# EAGLE design Thermocouple (EAGLE 7.1.0)
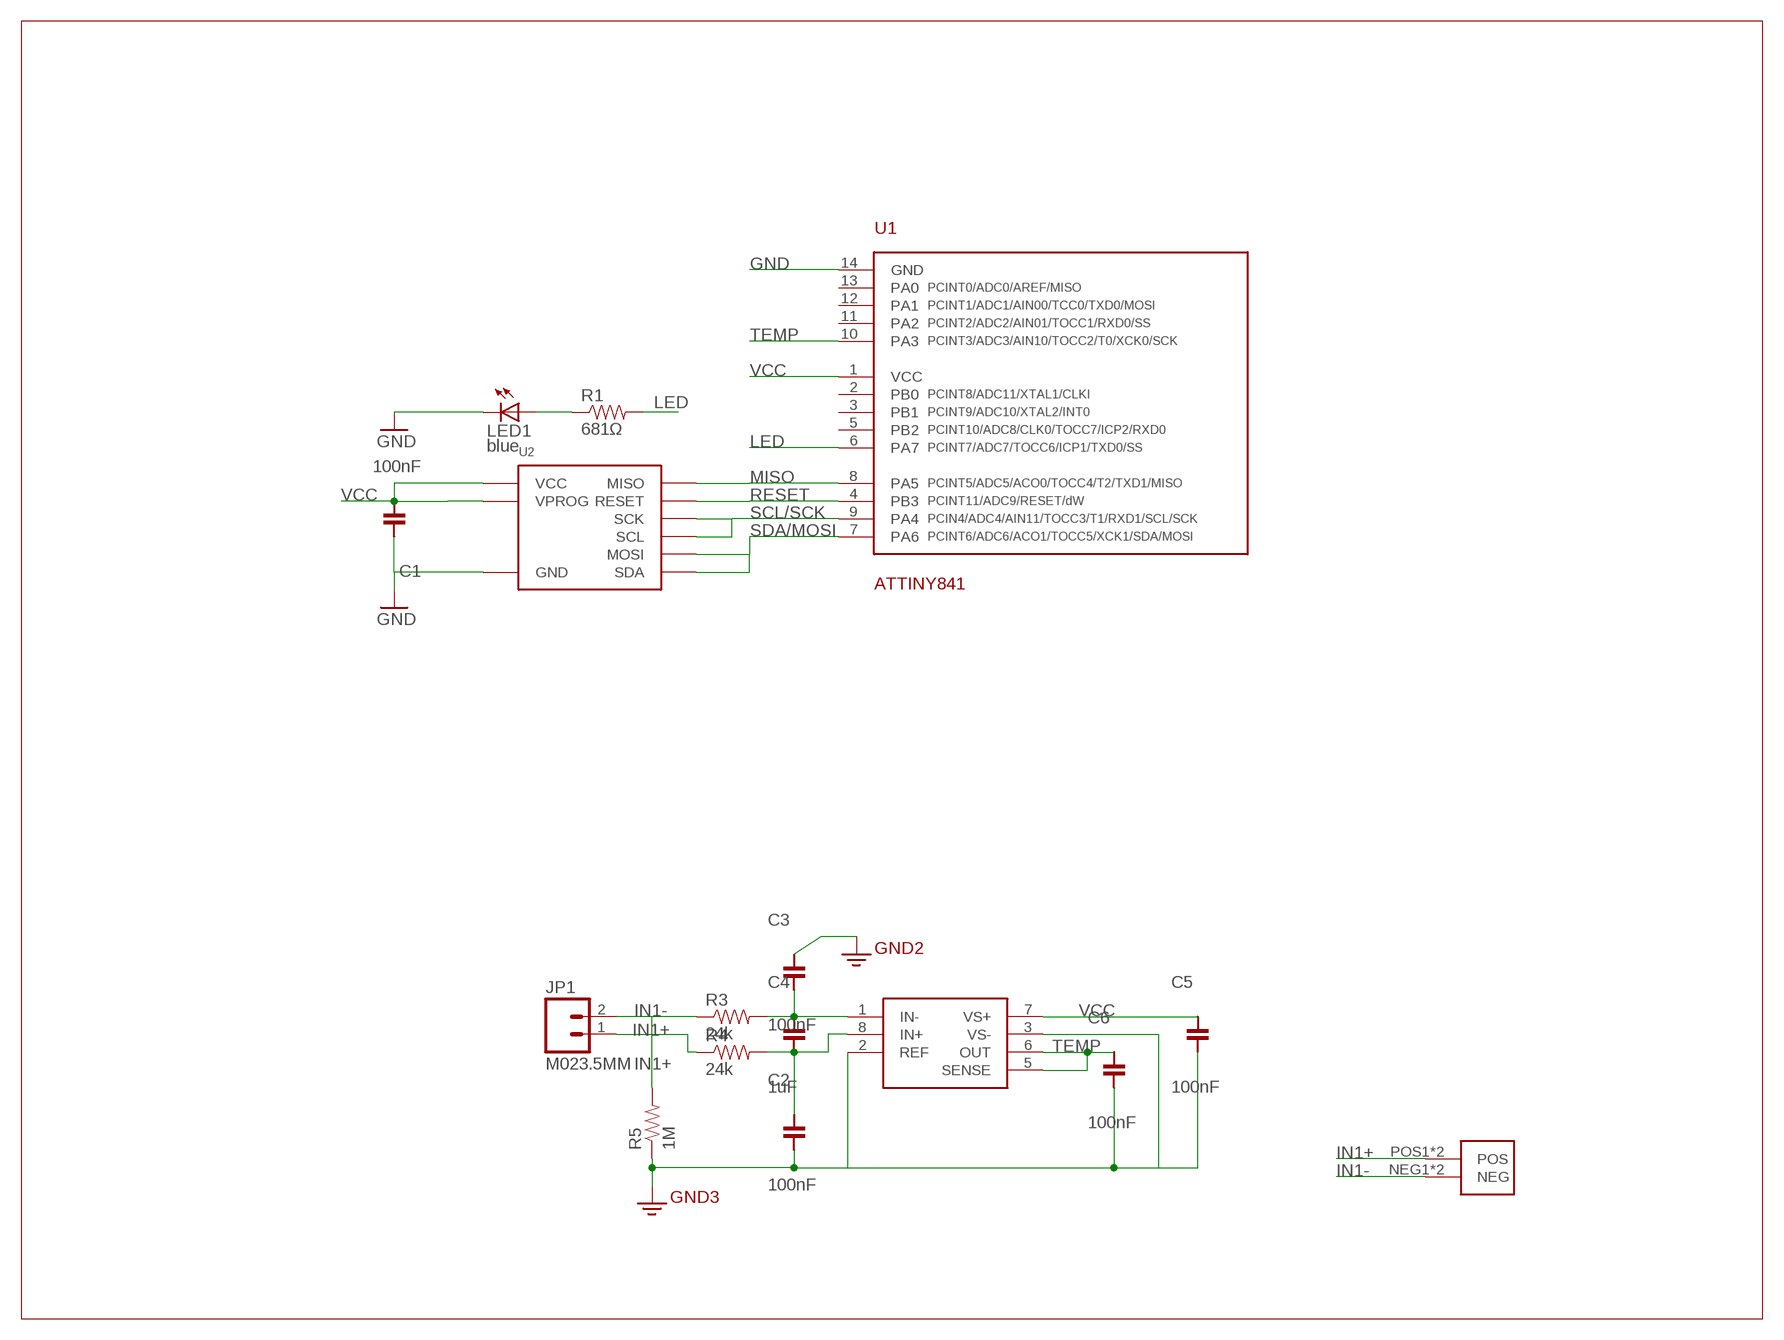
[diagram p0: schematic, sheet 1]

## Parts
C1  100nF  CAPACITOR-100NF  [0603]
C2  100nF  CAPACITOR-100NF  [0603]
C3  100nF  CAPACITOR-100NF  [0603]
C4  1uF  CAPACITOR-1UF  [0603]
C5  100nF  CAPACITOR-100NF  [0603]
C6  100nF  CAPACITOR-100NF  [0603]
JP1  M023.5MM  [SCREWTERMINAL-3.5MM-2]
LED1  blue  LED-0805-BLUE  [0805-LED]
R1  681Ω  RESISTOR-681Ω  [0603]
R3  24k  RESISTOR-0603  [0603]
R4  24k  RESISTOR-0603  [0603]
R5  1M  RESISTOR-0603  [0603]
U1  ATTINY841  [SOIC-14]
U2  EXCLUDE  DEVICE-PCB  [DEVICE-PCB]
U$1  AD8495  [MSOP-8]
U$4  THERMOCOUPLE-JACK  [THERMOCOUPLE-JACK]

## Nets
GND: C1.1 C2.2 C3.1 C5.2 C6.2 LED1.C R5.1 U1.14(GND) U2.BUS0(GND) U$1.2(REF) U$1.3(VS-) ; supply symbol labelled GND2
IN1+: JP1.1 R4.1 U$4.POS1(POS) U$4.POS2(POS)
IN1-: JP1.2 R3.1 R5.2 U$4.NEG1(NEG) U$4.NEG2(NEG)
LED: R1.2 U1.6(PA7)
MISO: U1.8(PA5) U2.PROG3(MISO)
N$3: C3.2 C4.1 R3.2 U$1.1(IN-)
N$4: C2.1 C4.2 R4.2 U$1.8(IN+)
N$8: LED1.A R1.1
RESET: U1.4(PB3) U2.PROG1(RESET)
SCL/SCK: U1.9(PA4) U2.BUS3(SCL) U2.PROG2(SCK)
SDA/MOSI: U1.7(PA6) U2.BUS1(SDA) U2.PROG4(MOSI)
TEMP: C6.1 U1.10(PA3) U$1.5(SENSE) U$1.6(OUT)
VCC: C1.2 C5.1 U1.1(VCC) U2.BUS2(VCC) U2.PROG0(VPROG) U$1.7(VS+)
Unconnected: U1.2(PB0) U1.3(PB1) U1.5(PB2) U1.11(PA2) U1.12(PA1) U1.13(PA0)

## Library data of the parts
C1-C3 C5 C6 = Modulo:CAPACITOR: Capacitor; PARTNUM: C0603C104K5RACTU
C4 = Modulo:CAPACITOR: Capacitor; PARTNUM: C0603C105K4RACTU
JP1 = SparkFun-Connectors:M02: Standard 2-pin 0.1" header. Use with - straight break away headers ( PRT-00116) - right angle break away headers (PRT-00553) - swiss pins (PRT-00743) - machine pins (PRT-00117) - female headers (PRT-00115) Molex polarized connector foot print use with: PRT-08233 with associated crimp pins and housings. 2.54_SCREWTERM for use with PRT-10571. 3.5mm Screw Terminal footprints for PRT-08084 5mm Screw Terminal footprints for use with PRT-08433; PARTNUM: OSTTE020104
LED1 = Modulo:LED: LED; PARTNUM: LTST-C171TBKT
R1 = Modulo:RESISTOR: Resistor Basic schematic elements and footprints for 0603, 1206, and PTH resistors.; PARTNUM: ERJ-3EKF6810V
R3 R4 = Modulo:RESISTOR: Resistor Basic schematic elements and footprints for 0603, 1206, and PTH resistors.; PARTNUM: ERJ-3EKF2402V
R5 = Modulo:RESISTOR: Resistor Basic schematic elements and footprints for 0603, 1206, and PTH resistors.; PARTNUM: ERJ-3EKF1004V
U1 = Modulo:ATTINY841; PARTNUM: ATTINY841-SSUR
U2 = Modulo:DEVICE-PCB: Modulo Footprint
U$1 = IntegerLabs:AD8495; PARTNUM: AD8495ARMZ-R7
U$4 = IntegerLabs:THERMOCOUPLE-JACK; PARTNUM: Keystone 3572, 3549

## Board
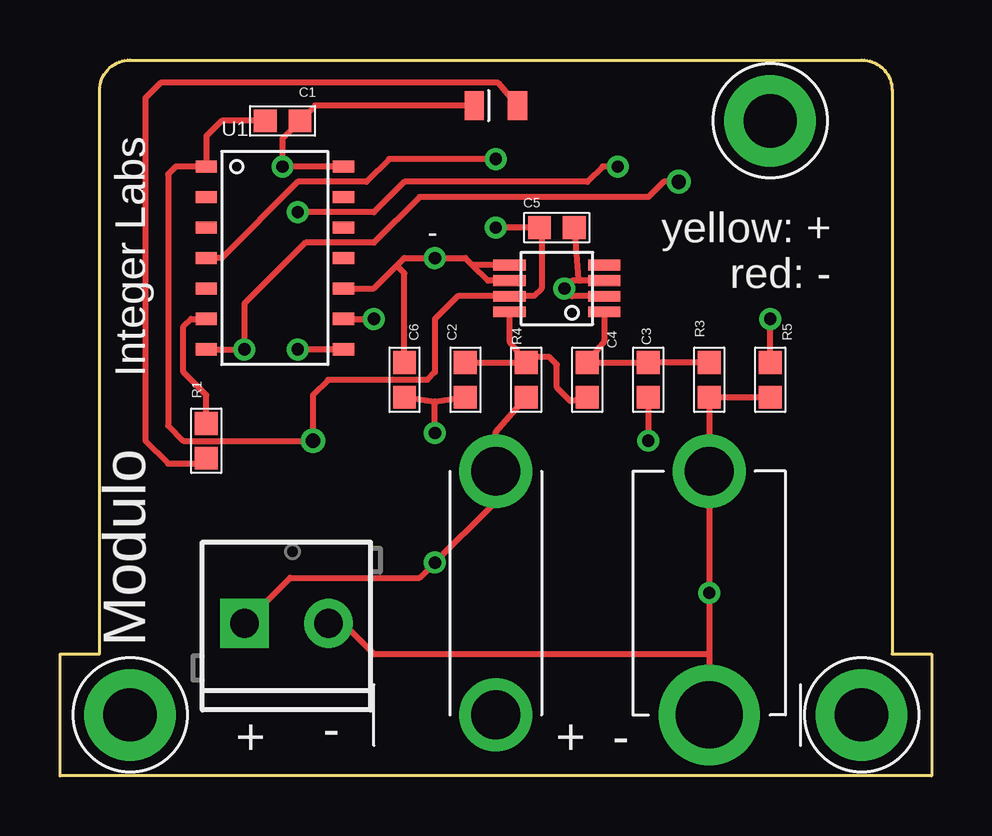
[diagram p1: board, top side]
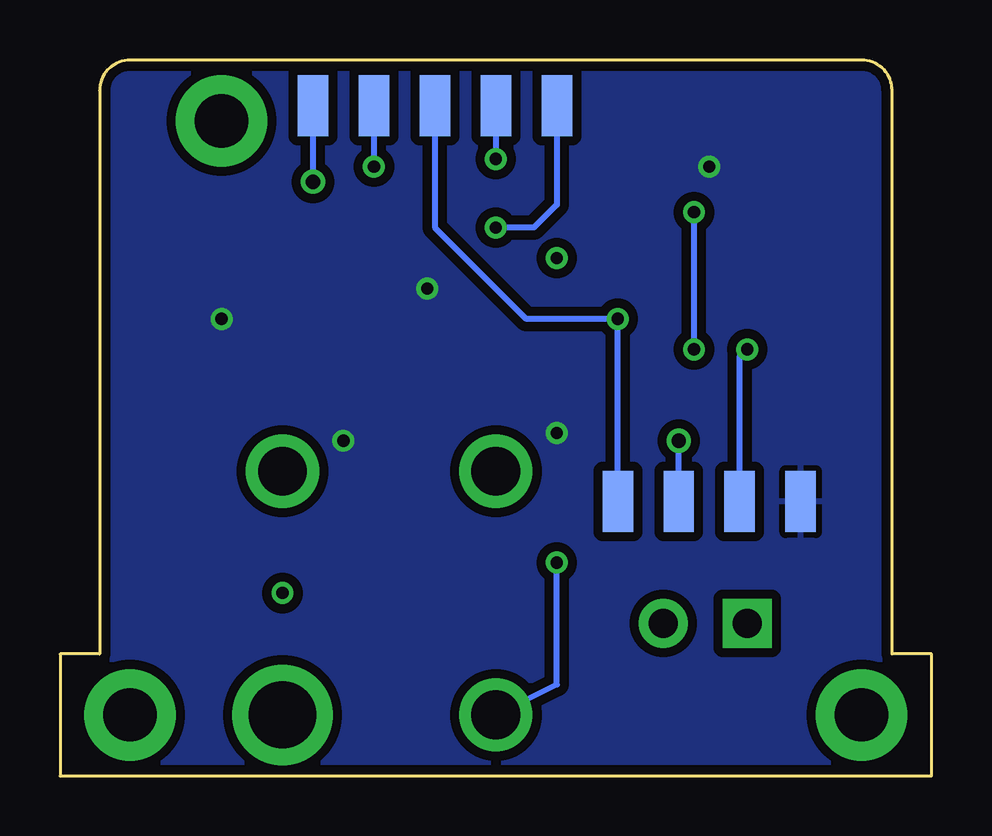
[diagram p2: board, bottom side, seen from below]

Size 36.32 x 29.84 mm. Coordinates in mm from the lower left corner, seen from the top.
Copper layers (1*16): Top 0.0178mm / dielectric 59mil / Bottom 0.0178mm
Design rules "SSC-EAGLE-2Lyr_v1.0.0.3 *": minimum track width 6mil, minimum drill 14mil, track to track 6mil, track to pad 6mil, pad to pad 6mil, via to via 6mil, smd to smd 6mil, copper to edge 1mil, drill to drill 16mil, minimum pad ring 8mil, minimum via ring 8mil, stop-mask expansion 3mil, vias tented up to drill 25mil, thermal gap 10mil

### Footprints (pad centres in the part's own frame; a part is rotated, then mirrored left to right if it is on the bottom)
0603 = smd 0.95 x 0.95: 1 -0.725,0; 2 0.725,0
SCREWTERMINAL-3.5MM-2 = drill 1.2 pad 2.032 square: 1 0,0 | drill 1.2 pad 2.032: 2 3.5,0
0805-LED = smd 1.2 x 0.8: A 0,-0.9; C 0,0.9
SOIC-14 = smd 0.508 x 0.889: 1 0,-3.175; 2 1.27,-3.175; 3 2.54,-3.175; 4 3.81,-3.175; 5 5.08,-3.175; 6 6.35,-3.175; 7 7.62,-3.175; 8 7.62,2.54; 9 6.35,2.54; 10 5.08,2.54; 11 3.81,2.54; 12 2.54,2.54; 13 1.27,2.54; 14 0,2.54
DEVICE-PCB = smd 1.27 x 2.54 bottom: BUS0 5.08,11.43; BUS1 7.62,11.43; BUS2 10.16,11.43; BUS3 12.7,11.43; PROG0 15.24,27.94; PROG1 17.78,27.94; PROG2 20.32,27.94; PROG3 22.86,27.94; PROG4 25.4,27.94 | drill 2.223 pad 3.81: P$1 2.54,2.54; P$2 33.02,2.54; P$3 29.21,27.305
MSOP-8 = smd 0.45 x 1.35: 1 -0.975,-1.975; 2 -0.325,-1.975; 3 0.325,-1.975; 4 0.975,-1.975; 5 0.975,1.975; 6 0.325,1.975; 7 -0.325,1.975; 8 -0.975,1.975
THERMOCOUPLE-JACK = drill 2.032: NEG1 8.89,10.16; POS1 0,0; POS2 0,10.16 | drill 2.794: NEG2 8.89,0

### Placement (x,y rotation side)
C1  9.27,27.3 180 top
C2  16.89,16.51 270 top
C3  24.51,16.51 90 top
C4  21.97,16.51 270 top
C5  20.7,22.86 0 top
C6  14.35,16.51 270 top
JP1  7.68,6.35 0 top
LED1  18.16,27.94 90 top
R1  6.1,13.97 90 top
R3  27.05,16.51 90 top
R4  19.43,16.51 90 top
R5  29.59,16.51 270 top
U1  9.27,25.4 270 top
U2  0.38,0 0 top
U$1  20.7,20.32 90 top
U$4  18.16,2.54 0 top

### Tracks (layer width: path | path; a pad name or v marks a point on that pad's centre or on a via)
GND  (via drill 0.51)
  Top 0.254: U$1.2 21.34,20 v21.02,20.32 21.34,20.64 21.65,20.64 | U$1.3 21.65,20.64 | C3.1 v24.51,13.97 | R5.1 v29.59,19.05 | C6.2 15.62,15.61 | 15.62,15.61 C2.2 | C5.2 21.6,20.7 21.65,20.64 | U1.14 v9.27,25.4 9.27,26.58 C1.1 10.63,27.94 LED1.C | v15.62,14.29 15.62,15.61
  pour Bottom (isolate 0.381): 0.38,31.43 0.38,-0.95 35.94,-0.95 35.94,31.43
IN1+  (via drill 0.51)
  Top 0.254: JP1.1 9.59,8.26 14.99,8.26 v15.62,8.89 18,11.27 U$4.POS2 18.16,14.34 R4.1
  Bottom 0.254: U$4.POS1 15.62,3.81 v15.62,8.89
IN1-  (via drill 0.51)
  Top 0.254: 27.05,5.08 v27.05,7.62 U$4.NEG1 R3.1 R5.2 | 27.05,5.08 U$4.NEG2 | JP1.2 11.81,6.35 13.08,5.08 27.05,5.08
LED
  Top 0.254: R1.2 6.1,15.88 5.14,16.83 5.14,18.73 5.46,19.05 U1.6
MISO  (via drill 0.51)
  Top 0.254: v23.24,25.4 22.61,25.4 21.97,24.77 14.35,24.77 13.08,23.5 v9.91,23.5 | U1.8 v9.91,17.78
  Bottom 0.254: U2.PROG3 v23.24,25.4 | v9.91,23.5 v9.91,17.78
N$3
  Top 0.254: U$1.1 22.68,18.11 C4.1 C3.2 R3.2
N$4
  Top 0.254: C4.2 21.28,15.61 20.7,16.19 20.7,17.14 20.38,17.46 19.48,17.46 R4.2 | U$1.8 18.73,18.11 R4.2 | C2.1 R4.2
N$8
  Top 0.254: R1.1 6.04,13.02 4.51,13.02 3.56,13.97 3.56,28.26 4.19,28.89 18.26,28.89 LED1.A
RESET  (via drill 0.51)
  Top 0.254: v18.16,25.72 13.72,25.72 12.76,24.77 9.91,24.77 6.73,21.59 U1.4
  Bottom 0.254: U2.PROG1 v18.16,25.72
SCL/SCK  (via drill 0.51)
  Top 0.254: U1.9 v13.08,19.05
  Bottom 0.254: U2.BUS3 v13.08,19.05 16.89,19.05 20.7,22.86 U2.PROG2
SDA/MOSI  (via drill 0.51, 0.6)
  Top 0.254: U1.7 v7.68,17.78 7.68,19.68 10.22,22.23 13.08,22.23 14.99,24.13 24.51,24.13 25.15,24.77 v25.78,24.77
  Bottom 0.254: U2.BUS1 8,17.46 v7.68,17.78 | U2.PROG4 v25.78,24.77
TEMP  (via drill 0.51)
  Top 0.254: U$1.5 17.19,21.3 | U$1.6 17.84,20.64 17.19,21.3 | U1.10 13.08,20.32 14.03,21.27 | 14.03,21.27 14.35,21.59 v15.62,21.59 16.89,21.59 17.19,21.3 | C6.1 14.35,20.95 14.03,21.27
VCC  (via drill 0.51, 0.6)
  Top 0.254: v18.16,22.86 C5.1 19.8,22.81 20.07,22.54 20.07,20.32 19.75,20 18.73,20 U$1.7 16.57,20 15.62,19.05 15.62,16.83 15.3,16.51 11.18,16.51 10.54,15.88 v10.54,13.97 5.14,13.97 4.51,14.61 4.51,25.08 4.83,25.4 U1.1 6.1,26.67 6.73,27.3 C1.2
  Bottom 0.254: U2.PROG0 15.62,23.81 16.57,22.86 v18.16,22.86 | U2.BUS2 v10.54,13.97

### Text on the board
tPlace: yellow: + | - | red: - | + | - | + | -